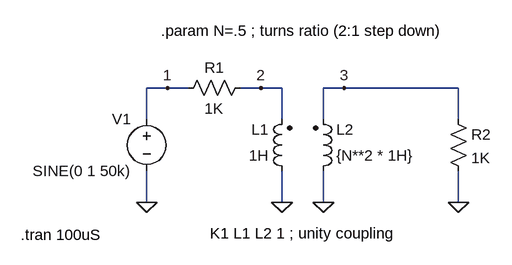
[diagram p0: schematic Transformer Example.asc]
Transformer Example.asc, the LTspice schematic file:
Version 4
SHEET 1 984 680
WIRE -160 240 -160 288
WIRE -160 160 -160 112
WIRE -160 112 -128 112
WIRE -16 112 16 112
WIRE 48 112 48 160
WIRE 48 240 48 288
WIRE 112 240 112 288
WIRE 320 240 320 288
WIRE 320 160 320 112
WIRE 112 160 112 112
WIRE 112 112 144 112
WIRE -128 112 -96 112
WIRE 16 112 48 112
WIRE 144 112 320 112
FLAG 48 288 0
FLAG -160 288 0
FLAG 112 288 0
FLAG 320 288 0
FLAG -128 112 1
FLAG 16 112 2
FLAG 144 112 3
SYMBOL res 0 96 R90
WINDOW 0 0 56 VBottom 0
WINDOW 3 32 56 VTop 0
SYMATTR InstName R1
SYMATTR Value 1K
SYMBOL voltage -160 144 M0
WINDOW 123 0 0 Left 0
WINDOW 39 0 0 Left 0
SYMATTR InstName V1
SYMATTR Value SINE(0 1 50k)
SYMBOL res 304 144 R0
SYMATTR InstName R2
SYMATTR Value 1K
SYMBOL ind2 64 256 R180
WINDOW 0 36 80 Left 0
WINDOW 3 36 40 Left 0
SYMATTR InstName L1
SYMATTR Value 1H
SYMATTR Type ind
SYMBOL ind2 96 256 M180
WINDOW 0 36 80 Left 0
WINDOW 3 36 40 Left 0
SYMATTR InstName L2
SYMATTR Value {N**2 * 1H}
SYMATTR Type ind
TEXT -354 338 Left 0 !.tran 100uS
TEXT 80 336 Center 0 !K1 L1 L2 1 ; unity coupling
TEXT 80 24 Center 0 !.param N=.5 ; turns ratio (2:1 step down)

The netlist it stands for:
* Transformer Example.asc
R1 2 1 1K
V1 1 0 SINE(0 1 50k)
R2 3 0 1K
L1 0 2 1H
L2 0 3 {N**2 * 1H}
.tran 100uS
K1 L1 L2 1 ; unity coupling
.param N=.5 ; turns ratio (2:1 step down)
.backanno
.end